# Altium schematic sheet 05_FOC_RS_Interface.SchDoc
size A4; Organization: OLTEST; Revision: 01; SheetNumber: 5; SheetTotal: 13; Название листа: Название листа; Разработчик: Бондарчук С.; Прибор: R100; АМАК.000000.000 Э3: R100.230.030.000-00; Дата: 16.04.2019; Формат: A4; WorkspaceName: R100_Boards_v1
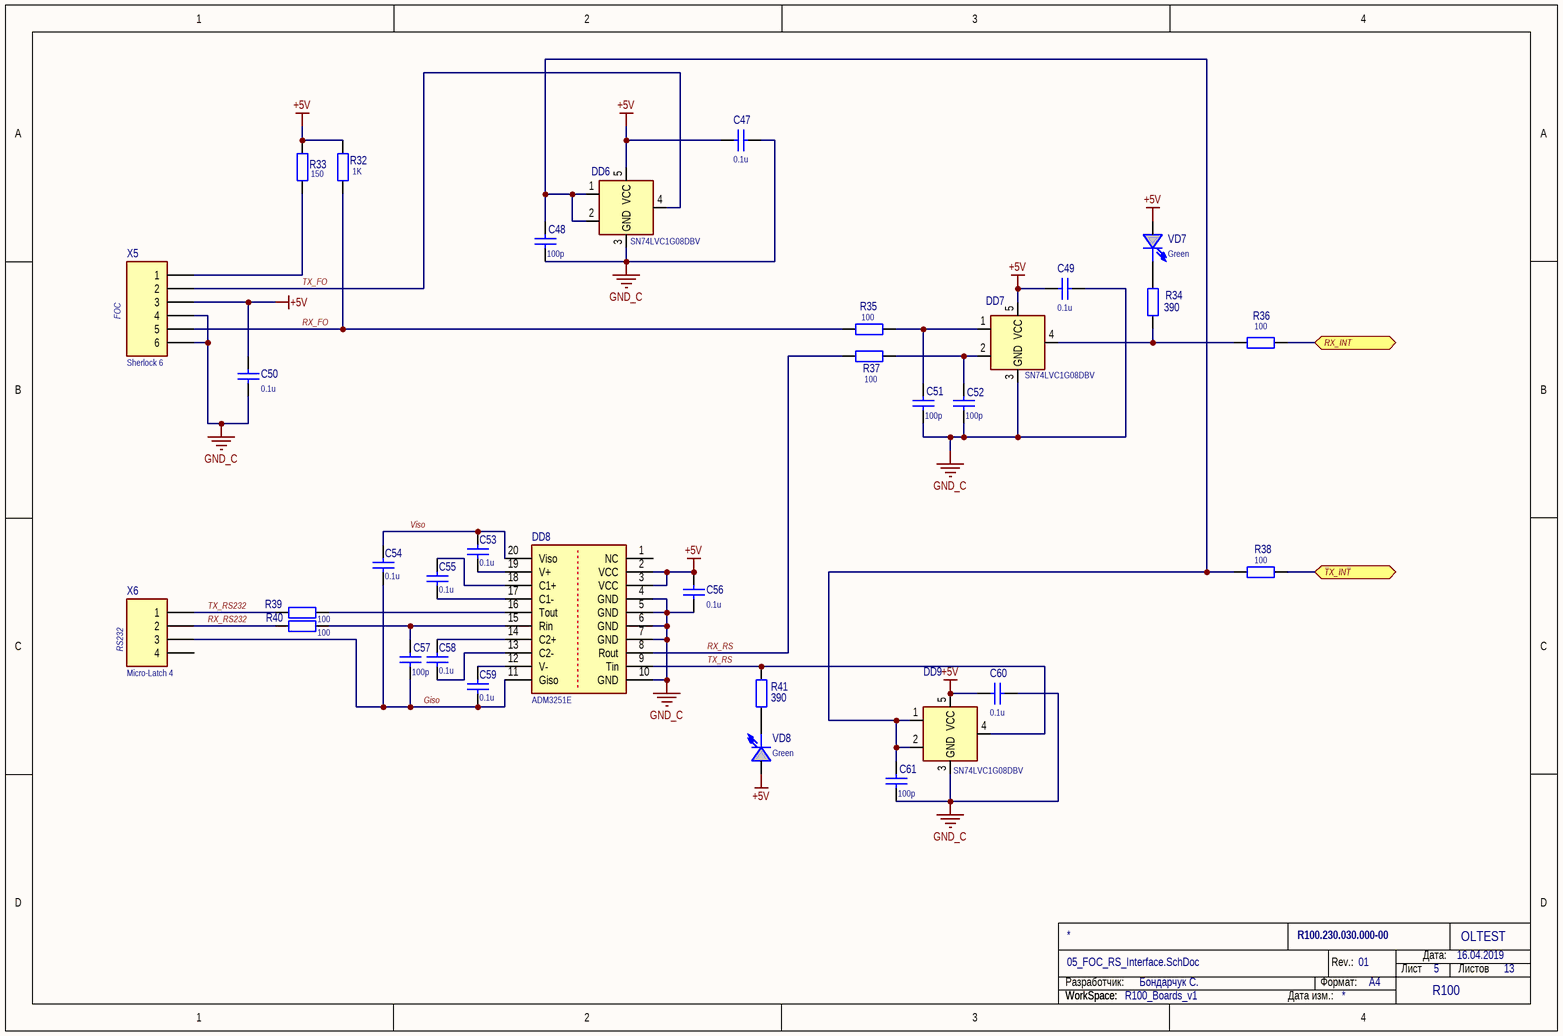
[diagram p0: 05_FOC_RS_Interface.SchDoc]

## Parts
C47  0.1u  [SMD_C_0603]
C48  100p  [SMD_C_0603]
C49  0.1u  [SMD_C_0603]
C50  0.1u  [SMD_C_0603]
C51  100p  [SMD_C_0603]
C52  100p  [SMD_C_0603]
C53  0.1u  [SMD_C_0603]
C54  0.1u  [SMD_C_0603]
C55  0.1u  [SMD_C_0603]
C56  0.1u  [SMD_C_0603]
C57  100p  [SMD_C_0603]
C58  0.1u  [SMD_C_0603]
C59  0.1u  [SMD_C_0603]
C60  0.1u  [SMD_C_0603]
C61  100p  [SMD_C_0603]
DD6  SN74LVC1G08DBV  [SOT-23(DBV)]
DD7  SN74LVC1G08DBV  [SOT-23(DBV)]
DD8  ADM3251E  [RW-20]
DD9  SN74LVC1G08DBV  [SOT-23(DBV)]
R32  1K  [SMD_R_0603]
R33  150  [SMD_R_0805]
R34  390  [SMD_R_0805]
R35  100  [SMD_R_0603]
R36  100  [SMD_R_0603]
R37  100  [SMD_R_0603]
R38  100  [SMD_R_0603]
R39  100  [SMD_R_0603]
R40  100  [SMD_R_0603]
R41  390  [SMD_R_0805]
VD7  value Green  [SMD_LED_LL_Green]  (hidden comment: LL-S172GC-2A)
VD8  value Green  [SMD_LED_LL_Green]  (hidden comment: LL-S172GC-2A)
X5  Sherlock 6  [35362-0650]
X6  Micro-Latch 4  [53253-0470]

## Ports
RX_INT, TX_INT

## Nets
+5V: C47.1 C49.1 C50.2 C56.2 C60.1 DD6.5(VCC) DD7.5(VCC) DD8.2(VCC) DD8.3(VCC) DD9.5(VCC) R32.2 R33.2 VD7.1(ANODE) VD8.1(ANODE) X5.3
GND_C: C47.2 C48.1 C49.2 C50.1 C51.1 C52.2 C56.1 C60.2 C61.1 DD6.3(GND) DD7.3(GND) DD8.4(GND) DD8.5(GND) DD8.6(GND) DD8.7(GND) DD8.10(GND) DD9.3(GND) X5.4 X5.6
Giso: C54.1 C57.1 C59.1 DD8.11(Giso) X6.3
RX_FO: R32.1 R35.1 X5.5
RX_INT: R36.2 ; port RX_INT
RX_RS: DD8.8(Rout) R37.1
RX_RS232: R40.1 X6.2
TX_FO: DD6.4 X5.2
TX_INT: R38.2 ; port TX_INT
TX_RS: DD8.9(Tin) DD9.4 R41.2
TX_RS232: R39.1 X6.1
Viso: C53.2 C54.2 DD8.20(Viso)
NetC48_2: C48.2 C61.2 DD6.1 DD6.2 DD9.1 DD9.2 R38.1
NetC51_2: C51.2 DD7.1 R35.2
NetC52_1: C52.1 DD7.2 R37.2
NetC53_1: C53.1 DD8.19(V+)
NetC55_1: C55.1 DD8.17(C1-)
NetC55_2: C55.2 DD8.18(C1+)
NetC57_2: C57.2 DD8.15(Rin) R40.2
NetC58_1: C58.1 DD8.13(C2-)
NetC58_2: C58.2 DD8.14(C2+)
NetC59_2: C59.2 DD8.12(V-)
NetDD7_4: DD7.4 R34.1 R36.1
NetDD8_16: DD8.16(Tout) R39.2
NetR33_1: R33.1 X5.1
NetR34_2: R34.2 VD7.2(CATHODE)
NetR41_1: R41.1 VD8.2(CATHODE)

Not connected (* = marked no-connect by the designer): DD8 1(NC); X6 4

## Notes on the sheet
- (near X5) FOC
- (near X6) RS232
- Разработчик:
- Формат:
- Rev.:
- Лист
- Дата:
- Листов
- WorkSpace:
- Дата изм.:
- (in symbol SN74LVC1G08DBV) &

## Library data of the parts
C47 C49 C50 C53-C56 C58-C60 = C0603 0.1u 50V 10%: SMD C 0603 MURATA 50V 10% X7R; PartNumber: GRM188R71H104K; Manufacturer: MURATA; Value: 0.1u
C48 C51 C52 C57 C61 = C0603 100p 100V 5%: SMD C 0603 MURATA 100V 5% NP0; PartNumber: GRM1885C2A101JA01; Manufacturer: MURATA; Value: 100p
DD6 DD7 DD9 = SN74LVC1G08DBV: 2-in AND; Manufacturer: Texas Instruments; PartNumber: SN74LVC1G08DBV
DD8 = ADM3251E: Isolated, Single-Channel, RS-232 Line Driver/Receiver; Manufacturer: Analog Device; PartNumber: ADM3251EARWZ
R32 = R0603 1K 1%: SMD R 0603 VISHAY 0.1W 75V 1% 100ppm; PartNumber: CRCW06031K00FK; Manufacturer: VISHAY; Value: 1K
R33 = R0805 150 1%: SMD 0805 VISHAY 0.125W 150V 1% 100ppm; PartNumber: CRCW0805150RFK; Manufacturer: VISHAY; Value: 150
R34 R41 = R0805 390R 1%: SMD R 0805 VISHAY 0.125W 150V 1% 100ppm; PartNumber: CRCW0805390RFK; Manufacturer: VISHAY; Value: 390
R35-R40 = R0603 100 1%: SMD R 0603 VISHAY 0.1W 75V 1% 100ppm; PartNumber: CRCW0603100RFK; Manufacturer: VISHAY; Value: 100
VD7 VD8 = LL-S172GC-2A: LED Green SMD; Manufacturer: Lucky Light; PartNumber: LL-S172GC-2A
X5 = 35363-0650: Sherlock 6 Side, 2A 125V 2mm; Manufacturer: MOLEX; PartNumber: 35362-0650
X6 = 53253-0470: Micro-Latch 4  LS=2 2A 125V PCB; Manufacturer: MOLEX; PartNumber: 53253-0470